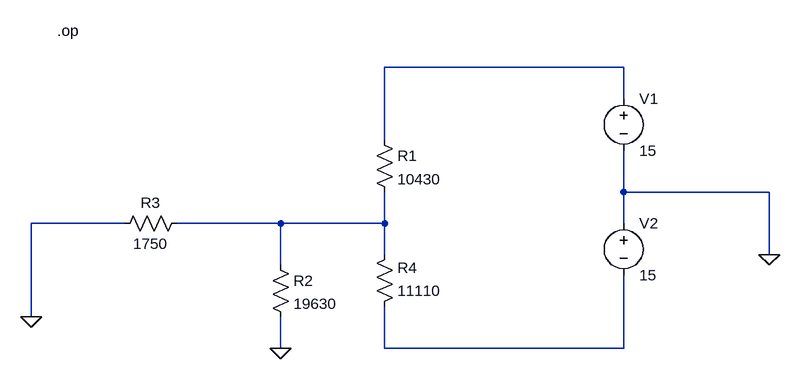
[diagram p0: schematic thevenin.asc]
thevenin.asc, the LTspice schematic file:
Version 4
SHEET 1 980 680
WIRE 736 -80 368 -80
WIRE 736 -32 736 -80
WIRE 368 32 368 -80
WIRE 736 112 736 48
WIRE 960 112 736 112
WIRE -32 160 -176 160
WIRE 208 160 48 160
WIRE 368 160 368 112
WIRE 368 160 208 160
WIRE 736 160 736 112
WIRE 368 208 368 160
WIRE 960 208 960 112
WIRE 208 224 208 160
WIRE -176 304 -176 160
WIRE 208 352 208 304
WIRE 368 352 368 288
WIRE 736 352 736 240
WIRE 736 352 368 352
FLAG 960 208 0
FLAG 208 352 0
FLAG -176 304 0
SYMBOL res 352 16 R0
SYMATTR InstName R1
SYMATTR Value 10430
SYMBOL res 192 208 R0
SYMATTR InstName R2
SYMATTR Value 19630
SYMBOL res 64 144 R90
WINDOW 0 0 56 VBottom 2
WINDOW 3 32 56 VTop 2
SYMATTR InstName R3
SYMATTR Value 1750
SYMBOL res 352 304 M180
WINDOW 0 36 76 Left 2
WINDOW 3 36 40 Left 2
SYMATTR InstName R4
SYMATTR Value 11110
SYMBOL voltage 736 -48 R0
WINDOW 123 0 0 Left 2
WINDOW 39 0 0 Left 2
SYMATTR InstName V1
SYMATTR Value 15
SYMBOL voltage 736 144 R0
WINDOW 123 0 0 Left 2
WINDOW 39 0 0 Left 2
SYMATTR InstName V2
SYMATTR Value 15
TEXT -136 -136 Left 2 !.op

The netlist it stands for:
* thevenin.asc
R1 N001 N002 10430
R2 N002 0 19630
R3 N002 0 1750
R4 N003 N002 11110
V1 N001 0 15
V2 0 N003 15
.op
.backanno
.end